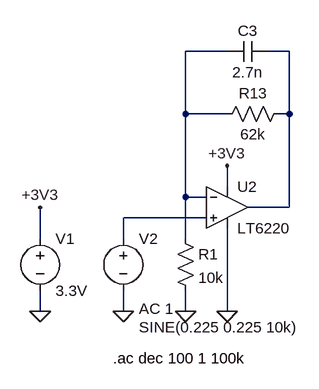
[diagram p0: schematic op_amp_filter_0_1.asc]
op_amp_filter_0_1.asc, the LTspice schematic file:
Version 4
SHEET 1 880 680
WIRE -864 -240 -928 -240
WIRE -768 -240 -800 -240
WIRE -928 -144 -928 -240
WIRE -864 -144 -928 -144
WIRE -768 -144 -768 -240
WIRE -768 -144 -784 -144
WIRE -864 -32 -864 -64
WIRE -928 -16 -928 -144
WIRE -896 -16 -928 -16
WIRE -768 0 -768 -144
WIRE -768 0 -832 0
WIRE -896 16 -1024 16
WIRE -1152 48 -1152 0
WIRE -1024 48 -1024 16
WIRE -928 48 -928 -16
WIRE -1152 160 -1152 128
WIRE -1024 160 -1024 128
WIRE -928 160 -928 128
WIRE -864 160 -864 32
FLAG -1152 0 +3V3
FLAG -1152 160 0
FLAG -864 160 0
FLAG -864 -64 +3V3
FLAG -1024 160 0
FLAG -928 160 0
SYMBOL voltage -1152 32 R0
WINDOW 123 0 0 Left 2
WINDOW 39 0 0 Left 2
SYMATTR InstName V1
SYMATTR Value 3.3V
SYMBOL Opamps\\LT6220 -864 0 R0
SYMATTR InstName U2
SYMBOL res -768 -160 R90
WINDOW 0 0 56 VBottom 2
WINDOW 3 32 56 VTop 2
SYMATTR InstName R13
SYMATTR Value 62k
SYMBOL cap -800 -256 R90
WINDOW 0 0 32 VBottom 2
WINDOW 3 32 32 VTop 2
SYMATTR InstName C3
SYMATTR Value 2.7n
SYMBOL voltage -1024 32 R0
WINDOW 123 24 124 Left 2
WINDOW 39 0 0 Left 2
WINDOW 3 24 152 Left 2
SYMATTR Value2 AC 1
SYMATTR InstName V2
SYMATTR Value SINE(0.225 0.225 10k)
SYMBOL res -944 32 R0
SYMATTR InstName R1
SYMATTR Value 10k
TEXT -1040 232 Left 2 !.ac dec 100 1 100k

The netlist it stands for:
* op_amp_filter_0_1.asc
V1 +3V3 0 3.3V
XU2 N003 N001 +3V3 0 N002 LT6220  ; pins In+ In- V+ V- OUT
R13 N002 N001 62k
C3 N002 N001 2.7n
V2 N003 0 SINE(0.225 0.225 10k) AC 1
R1 N001 0 10k
.ac dec 100 1 100k
.lib LTC4.lib
.backanno
.end